# EasyEDA schematic SCH_MicrowaveResistiveKeyb_2025-11-10.json
TITLE: Sheet_1; REV: 1.0; Date: 2025-11-02; Sheet: 1/1; Company: Your Company
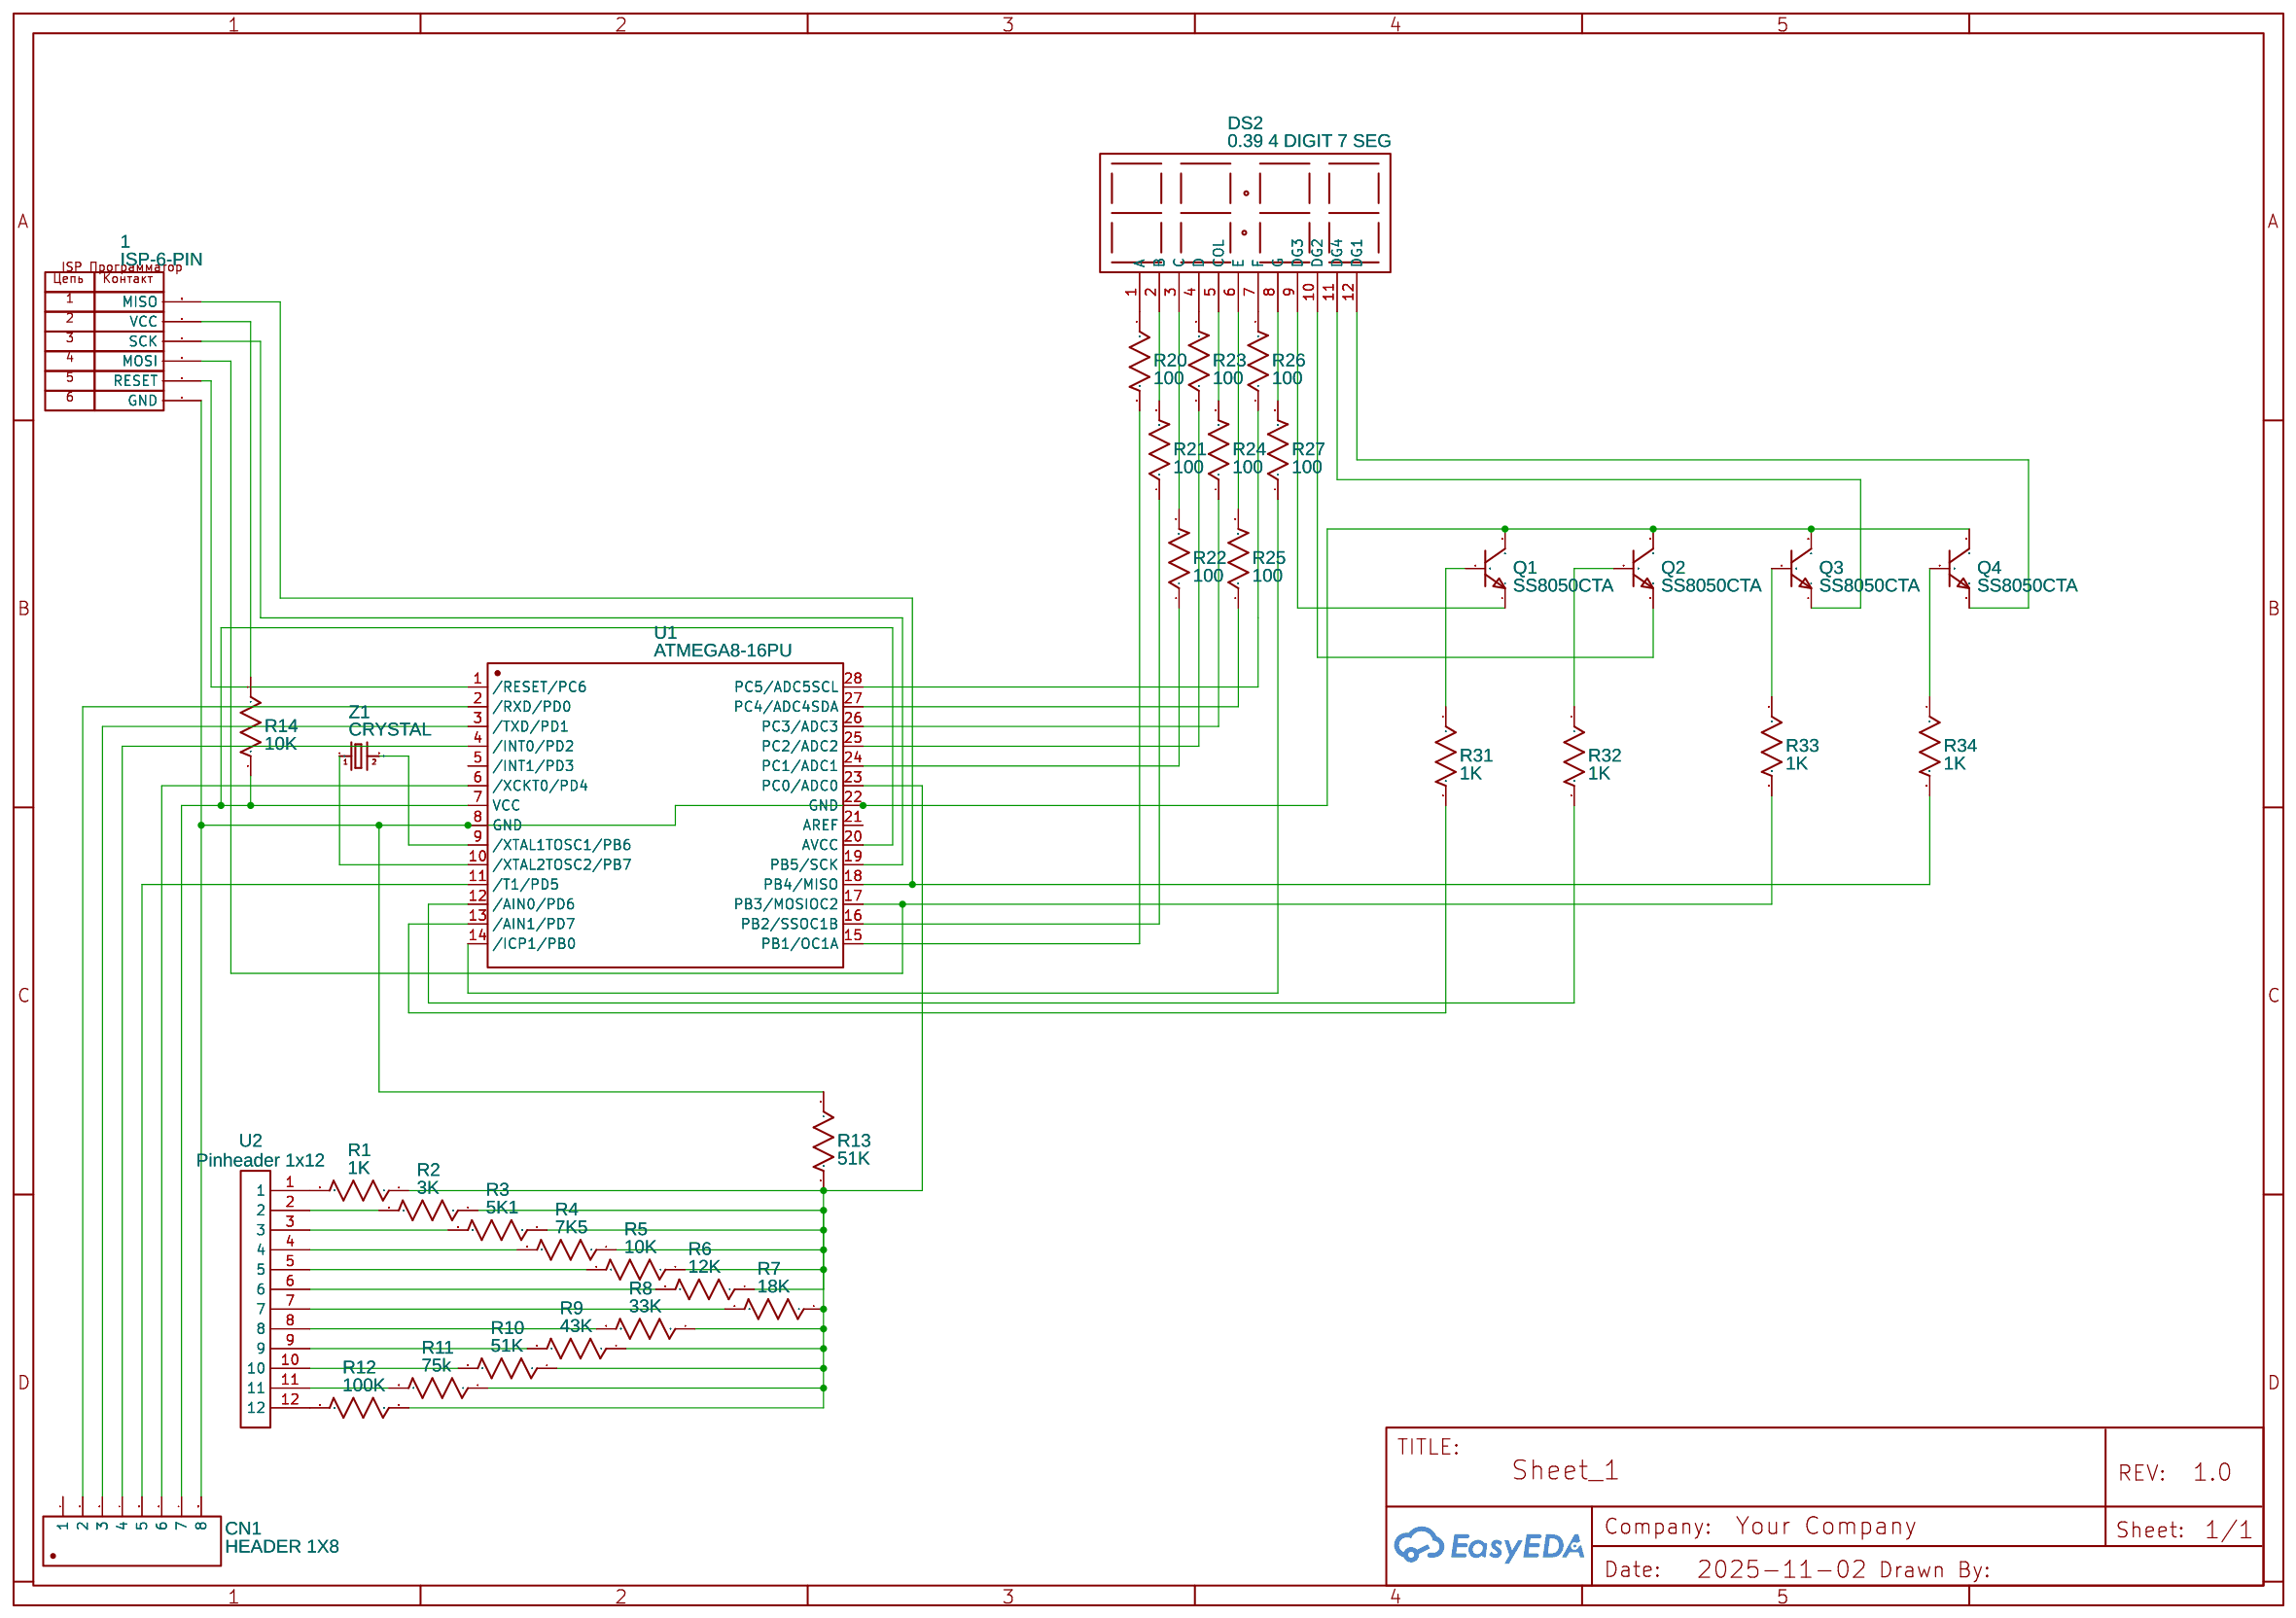
[diagram p0: schematic sheet]

## Parts
1  ISP-6-PIN  [ISP-6PIN-HEADER]
CN1  HEADER 1X8  [HDR-F-2.54_1X8]
DS2  0.39 4 DIGIT 7 SEG  [0.39 4 DIGIT 7 SEG.]
Q1  SS8050CTA  [TO-92-3_L4.8-W3.7-P2.54-L]
Q2  SS8050CTA  [TO-92-3_L4.8-W3.7-P2.54-L]
Q3  SS8050CTA  [TO-92-3_L4.8-W3.7-P2.54-L]
Q4  SS8050CTA  [TO-92-3_L4.8-W3.7-P2.54-L]
R1  1K  [RESC1608X60N]
R2  3K  [RESC1608X60N]
R3  5K1  [RESC1608X60N]
R4  7K5  [RESC1608X60N]
R5  10K  [RESC1608X60N]
R6  12K  [RESC1608X60N]
R7  18K  [RESC1608X60N]
R8  33K  [RESC1608X60N]
R9  43K  [RESC1608X60N]
R10  51K  [RESC1608X60N]
R11  75k  [RESC1608X60N]
R12  100K  [RESC1608X60N]
R13  51K  [RESC1608X60N]
R14  10K  [RESC1608X60N]
R20  100  [RESC1608X60N]
R21  100  [RESC1608X60N]
R22  100  [RESC1608X60N]
R23  100  [RESC1608X60N]
R24  100  [RESC1608X60N]
R25  100  [RESC1608X60N]
R26  100  [RESC1608X60N]
R27  100  [RESC1608X60N]
R31  1K  [RESC1608X60N]
R32  1K  [RESC1608X60N]
R33  1K  [RESC1608X60N]
R34  1K  [RESC1608X60N]
U1  ATMEGA8-16PU  [DIP-28_L35.0-W6.5-P2.54-LS7.6-BL]
U2  Pinheader 1x12  [PINHEADER 1X12]
Z1  CRYSTAL  [CRYSTAL-DIP-HC49/S]

## Library data of the parts
1 = ISP-6-PIN: Contributor: TeslyukGay
CN1 = HEADER 1X8: Contributor: bosphorusinnovations
DS2 = 0.39 4 DIGIT 7 SEG: Manufacturer Part: 0.39 Inch 4 Digit Common Anode 7 Segment Display Clock; Contributor: deenolx1; Manufacturer: TAKAMISAWA; link: http://www.tme.vn/Product.aspx?id=1622#page=pro_info; Supplier Part: YH-3492AG-X3, 1325
Q1-Q4 = SS8050CTA: Contributor: LCSC; Supplier: LCSC; Supplier Part: C327517; Manufacturer: onsemi(安森美); JLCPCB Part Class: Extended Part
R1-R14 R20-R27 R31-R34 = CRCW060323K2FKEA: RESISTOR, 0603
U1 = ATMEGA8-16PU: Supplier: LCSC; Manufacturer: MICROCHIP(美国微芯); Supplier Part: C112958; JLCPCB Part Class: Extended Part
U2 = Pinheader 1x12: Contributor: Khoa Pham Pham
Z1 = CRYSTAL: Contributor: Andrey Lazukin

## Nets
Net-(1-P$1): 1.P$1(MISO) R34.2 U1.18(PB4/MISO)
Net-(1-P$2): 1.P$2(VCC) R14.1
Net-(1-P$3): 1.P$3(SCK) U1.19(PB5/SCK)
Net-(1-P$4): 1.P$4(MOSI) R33.2 U1.17(PB3/MOSIOC2)
Net-(1-P$5): 1.P$5(RESET) U1.1(/RESET/PC6)
Net-(1-P$6): 1.P$6(GND) CN1.8 Q1.3(C) Q2.3(C) Q3.3(C) Q4.3(C) R13.1 U1.8(GND) U1.22(GND)
Net-(CN1-2): CN1.2 U1.2(/RXD/PD0)
Net-(CN1-3): CN1.3 U1.3(/TXD/PD1)
Net-(CN1-4): CN1.4 U1.4(/INT0/PD2)
Net-(CN1-5): CN1.5 U1.11(/T1/PD5)
Net-(CN1-6): CN1.6 U1.6(/XCKT0/PD4)
Net-(CN1-7): CN1.7 R14.2 U1.7(VCC) U1.20(AVCC)
Net-(DS2-1): DS2.1(A) R20.1
Net-(DS2-2): DS2.2(B) R21.2
Net-(DS2-3): DS2.3(C) R22.2
Net-(DS2-4): DS2.4(D) R23.2
Net-(DS2-5): DS2.5(COL) R24.2
Net-(DS2-6): DS2.6(E) R25.2
Net-(DS2-7): DS2.7(F) R26.2
Net-(DS2-8): DS2.8(G) R27.2
Net-(DS2-9): DS2.9(DG3) Q1.1(E)
Net-(DS2-10): DS2.10(DG2) Q2.1(E)
Net-(DS2-11): DS2.11(DG4) Q3.1(E)
Net-(DS2-12): DS2.12(DG1) Q4.1(E)
Net-(Q1-2): Q1.2(B) R31.1
Net-(Q2-2): Q2.2(B) R32.1
Net-(Q3-2): Q3.2(B) R33.1
Net-(Q4-2): Q4.2(B) R34.1
Net-(R1-1): R1.1 R2.1 R3.1 R4.1 R5.1 R6.1 R7.1 R8.1 R9.1 R10.1 R11.1 R12.1 R13.2 U1.23(PC0/ADC0)
Net-(R1-2): R1.2 U2.1
Net-(R2-2): R2.2 U2.2
Net-(R3-2): R3.2 U2.3
Net-(R4-2): R4.2 U2.4
Net-(R5-2): R5.2 U2.5
Net-(R6-2): R6.2 U2.6
Net-(R7-2): R7.2 U2.7
Net-(R8-2): R8.2 U2.8
Net-(R9-2): R9.2 U2.9
Net-(R10-2): R10.2 U2.10
Net-(R11-2): R11.2 U2.11
Net-(R12-2): R12.2 U2.12
Net-(R20-2): R20.2 U1.15(PB1/OC1A)
Net-(R21-1): R21.1 U1.16(PB2/SSOC1B)
Net-(R22-1): R22.1 U1.24(PC1/ADC1)
Net-(R23-1): R23.1 U1.25(PC2/ADC2)
Net-(R24-1): R24.1 U1.26(PC3/ADC3)
Net-(R25-1): R25.1 U1.27(PC4/ADC4SDA)
Net-(R26-1): R26.1 U1.28(PC5/ADC5SCL)
Net-(R27-1): R27.1 U1.14(/ICP1/PB0)
Net-(R31-2): R31.2 U1.13(/AIN1/PD7)
Net-(R32-2): R32.2 U1.12(/AIN0/PD6)
Net-(U1-9): U1.9(/XTAL1TOSC1/PB6) Z1.2
Net-(U1-10): U1.10(/XTAL2TOSC2/PB7) Z1.1

Not connected (* = marked no-connect by the designer): CN1 1; U1 5(/INT1/PD3) 21(AREF)
